# Altium schematic sheet Sheet4.SchDoc
size A4
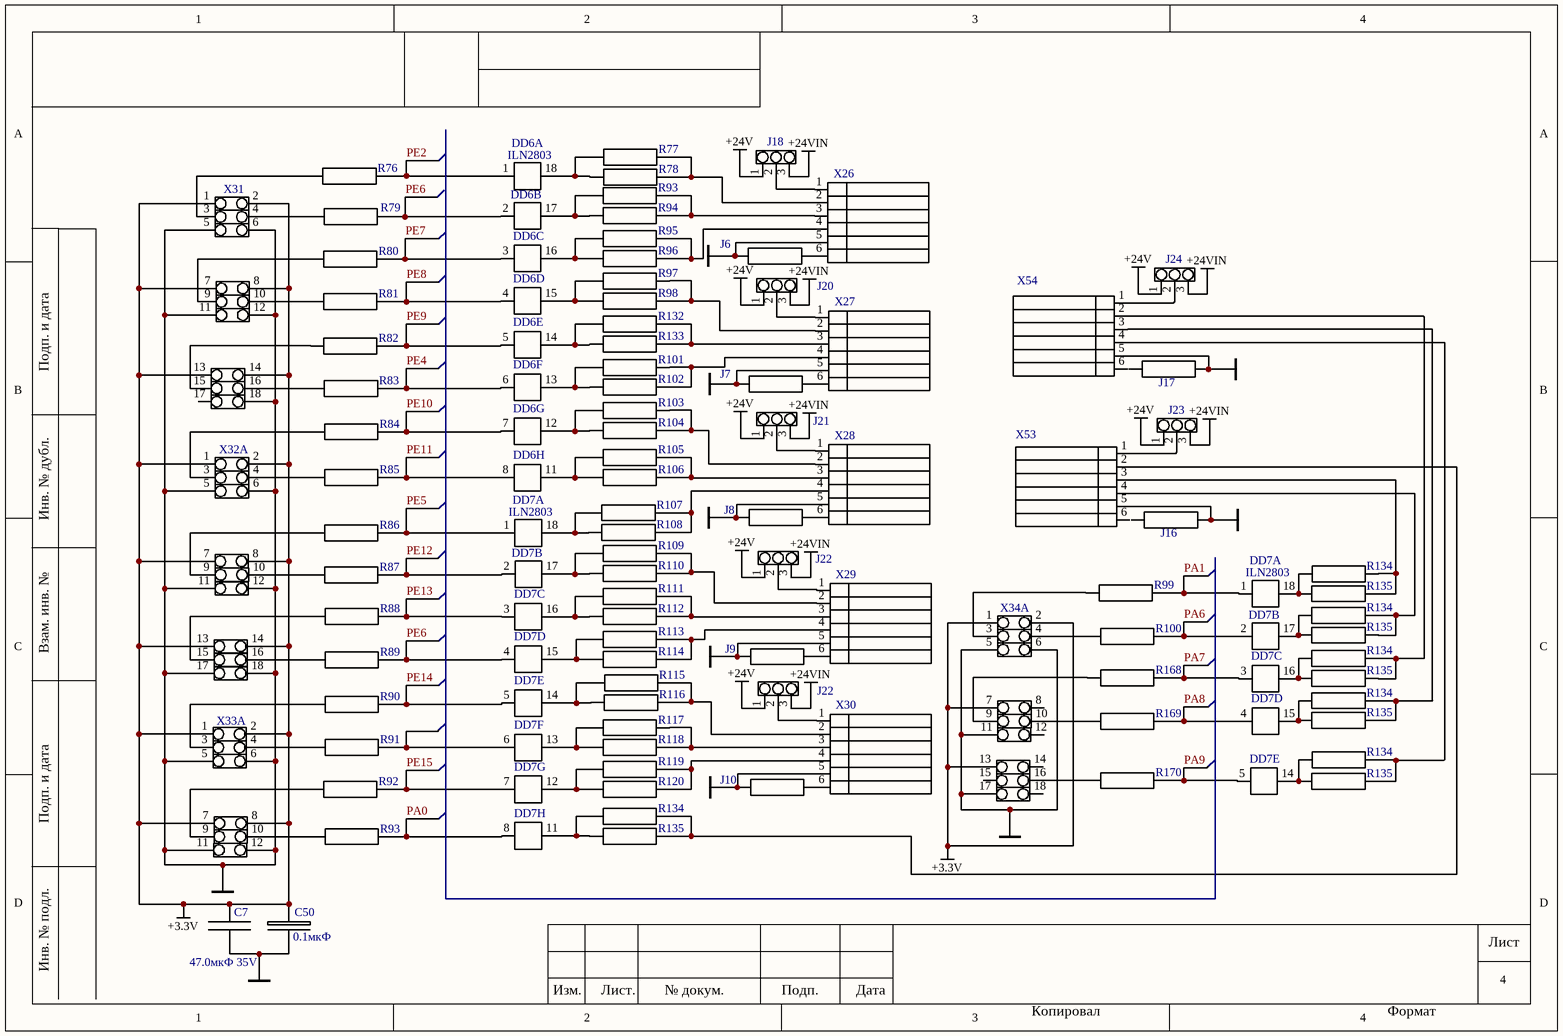
[diagram p0: Sheet4.SchDoc]

## Parts
(Parts that share a designator on the sheet are numbered #1, #2 ... from top to bottom, then left to right.)
*#1  X31  (part A of 10)
*#2  jamp20  (value not drawn)  (part F of 10)
*X31  jamp20  (value not drawn)  (part H of 10)
*X33  jamp20  (value not drawn)  (part E of 10)
C7  C0805  (value not drawn)
C50  C_e  (value not drawn)
DD6  ILN2803  (parts A,B,C,D,E,F,G,H of 8)
DD7#1  ILN2803  (parts A,B,C,D,E,F,G,H of 8)
DD7#2  ILN2803  (parts A,B,C,D,E of 8)
J6  R0805  (value not drawn)
J7  R0805  (value not drawn)
J8  R0805  (value not drawn)
J9  R0805  (value not drawn)
J10  R0805  (value not drawn)
J16  R0805  (value not drawn)
J17  R0805  (value not drawn)
J18  jamp3  (value not drawn)
J20  jamp3  (value not drawn)
J21  jamp3  (value not drawn)
J22#1  jamp3  (value not drawn)
J22#2  jamp3  (value not drawn)
J23  jamp3  (value not drawn)
J24  jamp3  (value not drawn)
R76  R0805  (value not drawn)
R77  R0805  (value not drawn)
R78  R0805  (value not drawn)
R79  R0805  (value not drawn)
R80  R0805  (value not drawn)
R81  R0805  (value not drawn)
R82  R0805  (value not drawn)
R83  R0805  (value not drawn)
R84  R0805  (value not drawn)
R85  R0805  (value not drawn)
R86  R0805  (value not drawn)
R87  R0805  (value not drawn)
R88  R0805  (value not drawn)
R89  R0805  (value not drawn)
R90  R0805  (value not drawn)
R91  R0805  (value not drawn)
R92  R0805  (value not drawn)
R93#1  R0805  (value not drawn)
R93#2  R0805  (value not drawn)
R94  R0805  (value not drawn)
R95  R0805  (value not drawn)
R96  R0805  (value not drawn)
R97  R0805  (value not drawn)
R98  R0805  (value not drawn)
R99  R0805  (value not drawn)
R100  R0805  (value not drawn)
R101  R0805  (value not drawn)
R102  R0805  (value not drawn)
R103  R0805  (value not drawn)
R104  R0805  (value not drawn)
R105  R0805  (value not drawn)
R106  R0805  (value not drawn)
R107  R0805  (value not drawn)
R108  R0805  (value not drawn)
R109  R0805  (value not drawn)
R110  R0805  (value not drawn)
R111  R0805  (value not drawn)
R112  R0805  (value not drawn)
R113  R0805  (value not drawn)
R114  R0805  (value not drawn)
R115  R0805  (value not drawn)
R116  R0805  (value not drawn)
R117  R0805  (value not drawn)
R118  R0805  (value not drawn)
R119  R0805  (value not drawn)
R120  R0805  (value not drawn)
R132  R0805  (value not drawn)
R133  R0805  (value not drawn)
R134#1  R0805  (value not drawn)
R134#2  R0805  (value not drawn)
R134#3  R0805  (value not drawn)
R134#4  R0805  (value not drawn)
R134#5  R0805  (value not drawn)
R134#6  R0805  (value not drawn)
R135#1  R0805  (value not drawn)
R135#2  R0805  (value not drawn)
R135#3  R0805  (value not drawn)
R135#4  R0805  (value not drawn)
R135#5  R0805  (value not drawn)
R135#6  R0805  (value not drawn)
R168  R0805  (value not drawn)
R169  R0805  (value not drawn)
R170  R0805  (value not drawn)
X26  PLS-6  (value not drawn)
X27  PLS-6  (value not drawn)
X28  PLS-6  (value not drawn)
X29  PLS-6  (value not drawn)
X30  PLS-6  (value not drawn)
X31  jamp20  (value not drawn)  (parts B,C,D,E,F,G,I of 10)
X32  jamp20  (value not drawn)  (parts A,B,C,D,E,F,G,H,I of 10)
X33  jamp20  (value not drawn)  (parts A,B,C,D,F of 10)
X34  jamp20  (value not drawn)  (parts A,B,C,D,E,G,H,I of 10)
X53  PLS-6  (value not drawn)
X54  PLS-6  (value not drawn)

## Nets
+3.3V: *#1.1 *#1.2 C7.1 C50.1 DD6.10 DD7#1.10 DD7#2.10 X31.7 X31.8 X31.13 X31.14 X32.1 X32.2 X32.7 X32.8 X32.13 X32.14 X33.1 X33.2 X33.7 X33.8 X34.1 X34.2 X34.7 X34.13
+24V: J18.1 J20.1 J21.1 J22#1.1 J22#2.1 J23.1 J24.1
+24VIN: J18.3 J20.3 J21.3 J22#1.3 J22#2.3 J23.3 J24.3
GND: *#2.11 C7.2 C50.2 DD6.9 DD7#1.9 DD7#2.9 J6.1 J7.1 J8.1 J9.1 J10.1 J16.2 J17.2 X26.5 X27.5 X28.5 X29.5 X30.5 X31.5 X31.6 X31.11 X31.12 X31.18 X32.5 X32.6 X32.11 X32.12 X32.17 X32.18 X33.5 X33.6 X33.11 X33.12 X34.5 X34.6 X34.17 X53.5 X54.5
PA0: DD7#1.8 R93#2.2
PA1: DD7#2.1 R99.2
PA6: DD7#2.2 R100.2
PA7: DD7#2.3 R168.2
PA8: DD7#2.4 R169.2
PA9: DD7#2.5 R170.2
PE2: DD6.1 R76.2
PE4: DD6.6 R83.2
PE5: DD7#1.1 R86.2
PE6: DD6.2 DD7#1.4 R79.2 R89.2
PE7: DD6.3 R80.2
PE8: DD6.4 R81.2
PE9: DD6.5 R82.2
PE10: DD6.7 R84.2
PE11: DD6.8 R85.2
PE12: DD7#1.2 R87.2
PE13: DD7#1.3 R88.2
PE14: DD7#1.5 R90.2
PE15: DD7#1.7 R92.2
Net*X31_15: *X31.15 R82.1
Net*X31_16: *X31.16 R83.1
Net*X33_9: *X33.9 R92.1
Net*X33_10: *X33.10 R93#2.1
NetDD6_11: DD6.11 R105.1 R106.1
NetDD6_12: DD6.12 R103.1 R104.1
NetDD6_13: DD6.13 R101.1 R102.1
NetDD6_14: DD6.14 R132.1 R133.1
NetDD6_15: DD6.15 R97.1 R98.1
NetDD6_16: DD6.16 R95.1 R96.1
NetDD6_17: DD6.17 R93#1.1 R94.1
NetDD6_18: DD6.18 R77.1 R78.1
NetDD7#1_6: DD7#1.6 R91.2
NetDD7#1_11: DD7#1.11 R134#6.1 R135#6.1
NetDD7#1_12: DD7#1.12 R119.1 R120.1
NetDD7#1_13: DD7#1.13 R117.1 R118.1
NetDD7#1_14: DD7#1.14 R115.1 R116.1
NetDD7#1_15: DD7#1.15 R113.1 R114.1
NetDD7#1_16: DD7#1.16 R111.1 R112.1
NetDD7#1_17: DD7#1.17 R109.1 R110.1
NetDD7#1_18: DD7#1.18 R107.1 R108.1
NetDD7#2_14: DD7#2.14 R134#5.1 R135#5.1
NetDD7#2_15: DD7#2.15 R134#4.1 R135#4.1
NetDD7#2_16: DD7#2.16 R134#3.1 R135#3.1
NetDD7#2_17: DD7#2.17 R134#2.1 R135#2.1
NetDD7#2_18: DD7#2.18 R134#1.1 R135#1.1
NetJ6_2: J6.2 X26.6
NetJ7_2: J7.2 X27.6
NetJ8_2: J8.2 X28.6
NetJ9_2: J9.2 X29.6
NetJ10_2: J10.2 X30.6
NetJ18_2: J18.2 X26.1
NetJ20_2: J20.2 X27.1
NetJ21_2: J21.2 X28.1
NetJ22#1_2: J22#1.2 X29.1
NetJ22#2_2: J22#2.2 X30.1
NetJ23_2: J23.2 X53.1
NetJ24_2: J24.2 X54.1
NetR76_1: R76.1 X31.3
NetR77_2: R77.2 R78.2 X26.2
NetR79_1: R79.1 X31.4
NetR80_1: R80.1 X31.9
NetR81_1: R81.1 X31.10
NetR84_1: R84.1 X32.3
NetR85_1: R85.1 X32.4
NetR86_1: R86.1 X32.9
NetR87_1: R87.1 X32.10
NetR88_1: R88.1 X32.15
NetR89_1: R89.1 X32.16
NetR90_1: R90.1 X33.3
NetR91_1: R91.1 X33.4
NetR93#1_2: R93#1.2 R94.2 X26.3
NetR95_2: R95.2 R96.2 X26.4
NetR97_2: R97.2 R98.2 X27.2
NetR99_1: R99.1 X34.3
NetR100_1: R100.1 X34.4
NetR101_2: R101.2 R102.2 X27.4
NetR103_2: R103.2 R104.2 X28.2
NetR105_2: R105.2 R106.2 X28.3
NetR107_2: R107.2 R108.2 X28.4
NetR109_2: R109.2 R110.2 X29.2
NetR111_2: R111.2 R112.2 X29.3
NetR113_2: R113.2 R114.2 X29.4
NetR115_2: R115.2 R116.2 X30.2
NetR117_2: R117.2 R118.2 X30.3
NetR119_2: R119.2 R120.2 X30.4
NetR132_2: R132.2 R133.2 X27.3
NetR134#1_2: R134#1.2 R135#1.2 X53.3
NetR134#2_2: R134#2.2 R135#2.2 X53.4
NetR134#3_2: R134#3.2 R135#3.2 X54.2
NetR134#4_2: R134#4.2 R135#4.2 X54.3
NetR134#5_2: R134#5.2 R135#5.2 X54.4
NetR134#6_2: R134#6.2 R135#6.2 X53.2
NetR168_1: R168.1 X34.9
NetR169_1: R169.1 X34.10
NetR170_1: R170.1 X34.16

Not connected (* = marked no-connect by the designer): *#2 12; J16 1; J17 1; X31 17; X34 8 14 15 18; X53 6; X54 6

## Notes on the sheet
- 4
- Подп. и дата
- Инв. № дубл.
- Взам. инв. №
- Инв. № подл.
- Лист
- Изм.
- Лист.
- № докум.
- Подп.
- Дата
- Копировал
- Формат
- (in symbol C0805) 47.0мкФ 35V
- (in symbol C_e) 0.1мкФ

## Library data of the parts
*#1 = jamp20